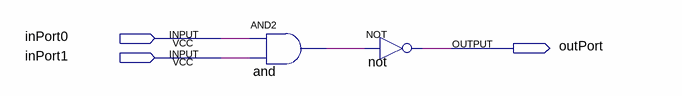
[diagram p0: schematic sheet]
// Quartus schematic NAND2Gate.bdf as structural Verilog: 2 symbols, 3 pins
module NAND2Gate (
  input  inPort0,
  input  inPort1,
  output outPort
);

  wire and_out;

  and \and  (and_out, inPort0, inPort1);
  not \not  (outPort, and_out);
endmodule
